# EAGLE design 150555-1-Platino-v1.4 (EAGLE 7.3.0)
AUTHOR: CPV; NRS: 150555-I; REV: 1.4

## Sheet 1 of 3
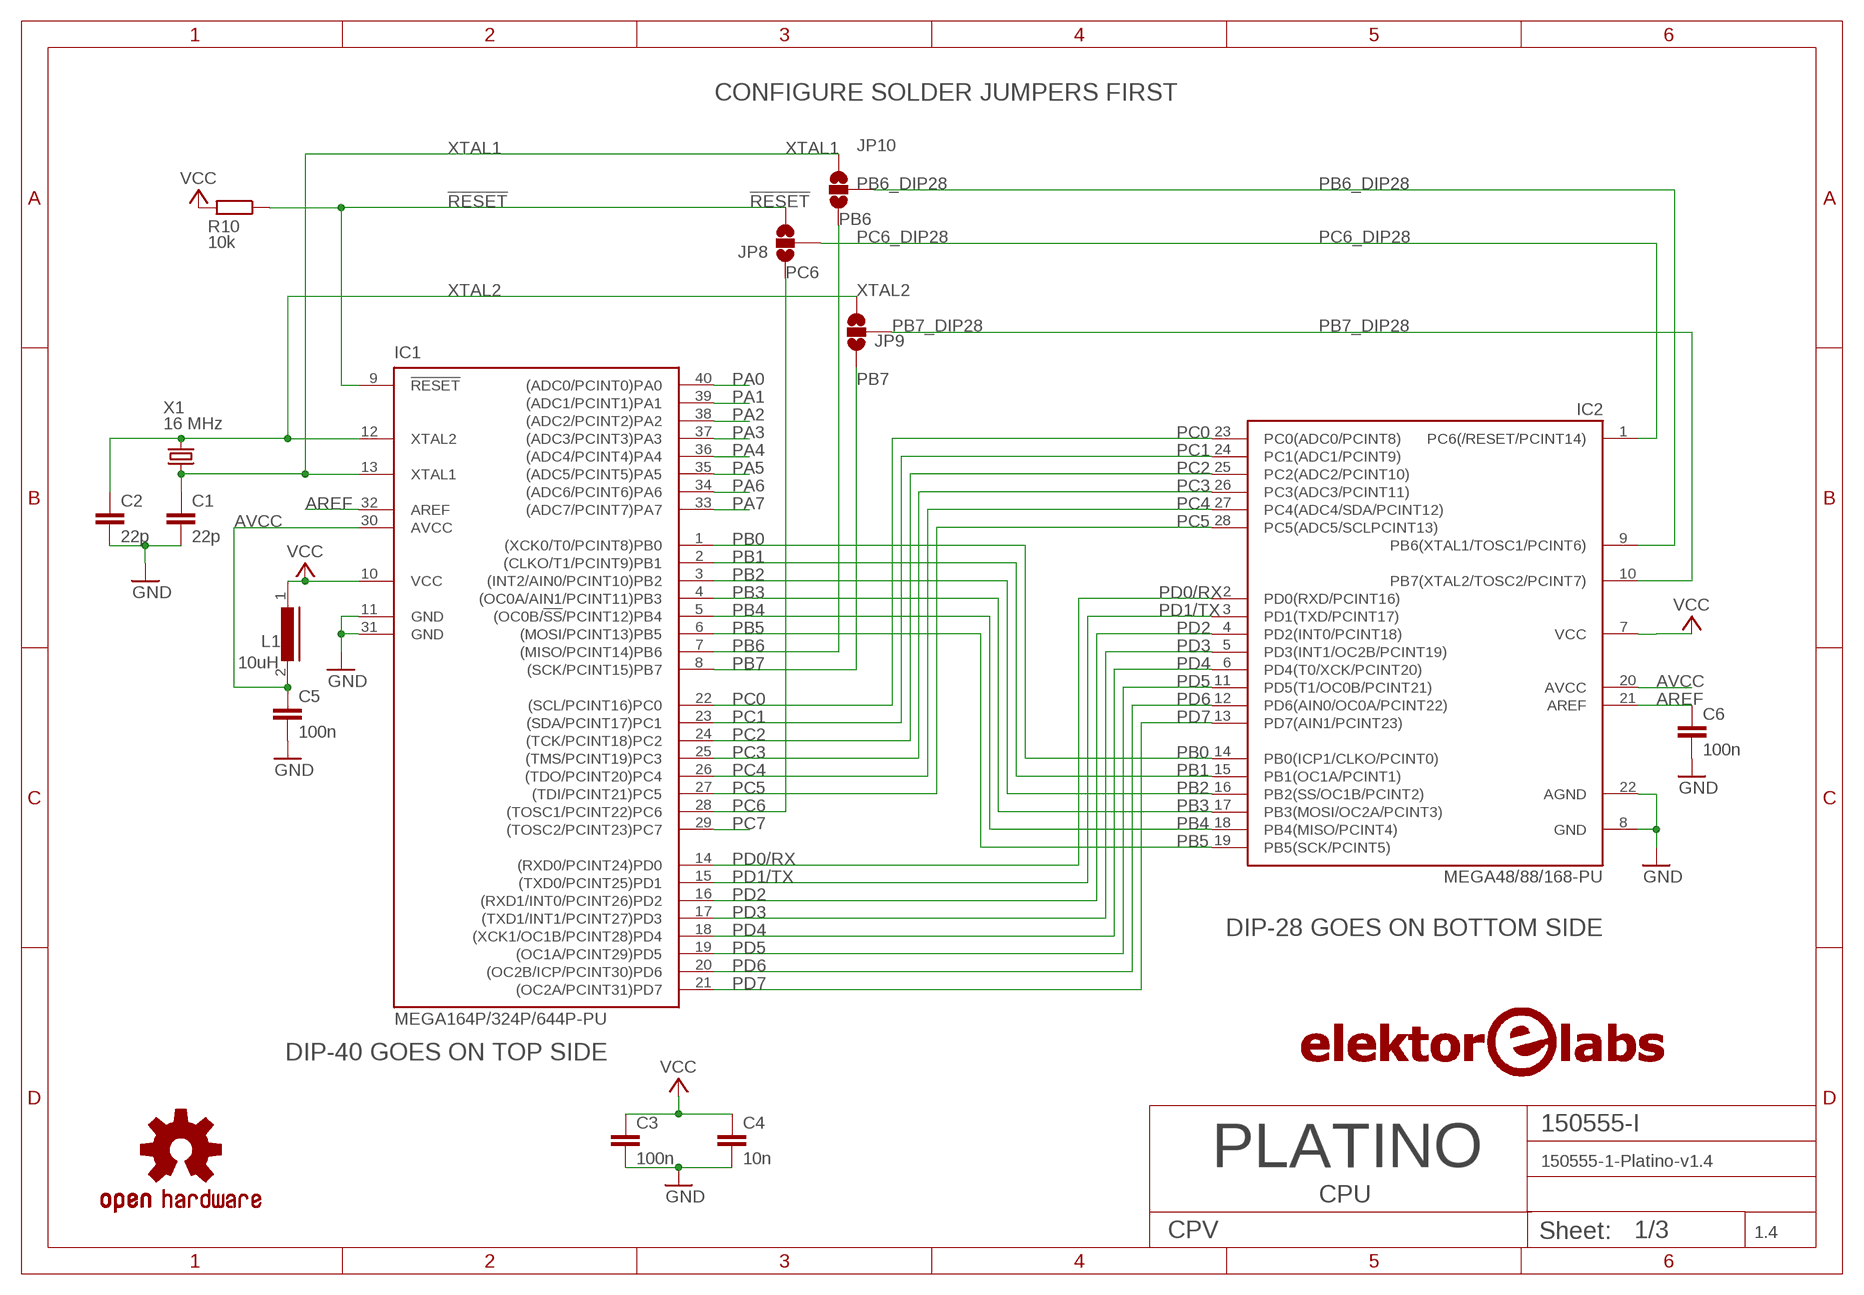
[diagram p0: schematic, sheet 1]

### Parts
C1  22p  C-NP-22PF-2.5MM  [ELPP-CNP-250]
C2  22p  C-NP-22PF-2.5MM  [ELPP-CNP-250]
C3  100n  C-NP-100NF-5.08MM  [ELPP-CNP-508]
C4  10n  C-NP-10NF-2.54MM  [ELPP-CNP-254]
C5  100n  C-NP-100NF-5.08MM  [ELPP-CNP-508]
C6  100n  C-NP-100NF-5.08MM  [ELPP-CNP-508]
IC1  MEGA164P/324P/644P-PU  [DIL40]
IC2  MEGA48/88/168-PU  [DIL28-3]
JP8  SOLDERJUMPER_2WAYT  [SJ_2]
JP9  SOLDERJUMPER_2WAYT  [SJ_2]
JP10  SOLDERJUMPER_2WAYT  [SJ_2]
L1  10uH  L-10UH-10MM  [ELPP-L-0207-1000]
LOGO2  LOGO-ELEKTOR-LABS-25MM  [EPP-LOGO-ELEKTOR-LABS-25MM]
R10  10k  R-10K-10MM  [ELPP-R-0207-1000]
U$2  OSHW-LOGOM  [OSHW-LOGO-M]
X1  16 MHz  X-CRYSTAL-16MHZ-  [ELPP-HC49]

### Nets
!RESET: IC1.9(!RESET) JP8.3 R10.1 ; also sheet 3
AREF: C6.1 IC1.32(AREF) IC2.21(AREF) ; also sheet 3
AVCC: C5.1 IC1.30(AVCC) IC2.20(AVCC) L1.2
GND: C1.2 C2.2 C3.2 C4.2 C5.2 C6.2 IC1.11(GND) IC1.31(GND) IC2.8(GND) IC2.22(AGND) ; also sheet 2,3
PA0: IC1.40((ADC0/PCINT0)PA0) ; also sheet 3
PA1: IC1.39((ADC1/PCINT1)PA1) ; also sheet 3
PA2: IC1.38((ADC2/PCINT2)PA2) ; also sheet 3
PA3: IC1.37((ADC3/PCINT3)PA3) ; also sheet 3
PA4: IC1.36((ADC4/PCINT4)PA4) ; also sheet 3
PA5: IC1.35((ADC5/PCINT5)PA5) ; also sheet 3
PA6: IC1.34((ADC6/PCINT6)PA6) ; also sheet 3
PA7: IC1.33((ADC7/PCINT7)PA7) ; also sheet 3
PB0: IC1.1((XCK0/T0/PCINT8)PB0) IC2.14(PB0(ICP1/CLKO/PCINT0)) ; also sheet 2,3
PB1: IC1.2((CLKO/T1/PCINT9)PB1) IC2.15(PB1(OC1A/PCINT1)) ; also sheet 2,3
PB2: IC1.3((INT2/AIN0/PCINT10)PB2) IC2.16(PB2(SS/OC1B/PCINT2)) ; also sheet 2,3
PB3: IC1.4((OC0A/AIN1/PCINT11)PB3) IC2.17(PB3(MOSI/OC2A/PCINT3)) ; also sheet 2,3
PB4: IC1.5((OC0B/!SS!/PCINT12)PB4) IC2.18(PB4(MISO/PCINT4)) ; also sheet 2,3
PB5: IC1.6((MOSI/PCINT13)PB5) IC2.19(PB5(SCK/PCINT5)) ; also sheet 2,3
PB6: IC1.7((MISO/PCINT14)PB6) JP10.1 ; also sheet 2,3
PB6_DIP28: IC2.9(PB6(XTAL1/TOSC1/PCINT6)) JP10.2
PB7: IC1.8((SCK/PCINT15)PB7) JP9.1 ; also sheet 2,3
PB7_DIP28: IC2.10(PB7(XTAL2/TOSC2/PCINT7)) JP9.2
PC0: IC1.22((SCL/PCINT16)PC0) IC2.23(PC0(ADC0/PCINT8)) ; also sheet 2,3
PC1: IC1.23((SDA/PCINT17)PC1) IC2.24(PC1(ADC1/PCINT9)) ; also sheet 2,3
PC2: IC1.24((TCK/PCINT18)PC2) IC2.25(PC2(ADC2/PCINT10)) ; also sheet 2,3
PC3: IC1.25((TMS/PCINT19)PC3) IC2.26(PC3(ADC3/PCINT11)) ; also sheet 2,3
PC4: IC1.26((TDO/PCINT20)PC4) IC2.27(PC4(ADC4/SDA/PCINT12)) ; also sheet 2,3
PC5: IC1.27((TDI/PCINT21)PC5) IC2.28(PC5(ADC5/SCLPCINT13)) ; also sheet 2,3
PC6: IC1.28((TOSC1/PCINT22)PC6) JP8.1 ; also sheet 2,3
PC6_DIP28: IC2.1(PC6(/RESET/PCINT14)) JP8.2
PC7: IC1.29((TOSC2/PCINT23)PC7) ; also sheet 2,3
PD0/RX: IC1.14((RXD0/PCINT24)PD0) IC2.2(PD0(RXD/PCINT16)) ; also sheet 3
PD1/TX: IC1.15((TXD0/PCINT25)PD1) IC2.3(PD1(TXD/PCINT17)) ; also sheet 3
PD2: IC1.16((RXD1/INT0/PCINT26)PD2) IC2.4(PD2(INT0/PCINT18)) ; also sheet 2,3
PD3: IC1.17((TXD1/INT1/PCINT27)PD3) IC2.5(PD3(INT1/OC2B/PCINT19)) ; also sheet 2,3
PD4: IC1.18((XCK1/OC1B/PCINT28)PD4) IC2.6(PD4(T0/XCK/PCINT20)) ; also sheet 2,3
PD5: IC1.19((OC1A/PCINT29)PD5) IC2.11(PD5(T1/OC0B/PCINT21)) ; also sheet 2,3
PD6: IC1.20((OC2B/ICP/PCINT30)PD6) IC2.12(PD6(AIN0/OC0A/PCINT22)) ; also sheet 2,3
PD7: IC1.21((OC2A/PCINT31)PD7) IC2.13(PD7(AIN1/PCINT23)) ; also sheet 2,3
VCC: C3.1 C4.1 IC1.10(VCC) IC2.7(VCC) L1.1 R10.2 ; also sheet 2,3
XTAL1: C1.1 IC1.13(XTAL1) JP10.3 X1.1
XTAL2: C2.1 IC1.12(XTAL2) JP9.3 X1.2

### Notes on the sheet
- CONFIGURE SOLDER JUMPERS FIRST
- DIP-28 GOES ON BOTTOM SIDE
- DIP-40 GOES ON TOP SIDE
- PLATINO
- CPU

## Sheet 2 of 3
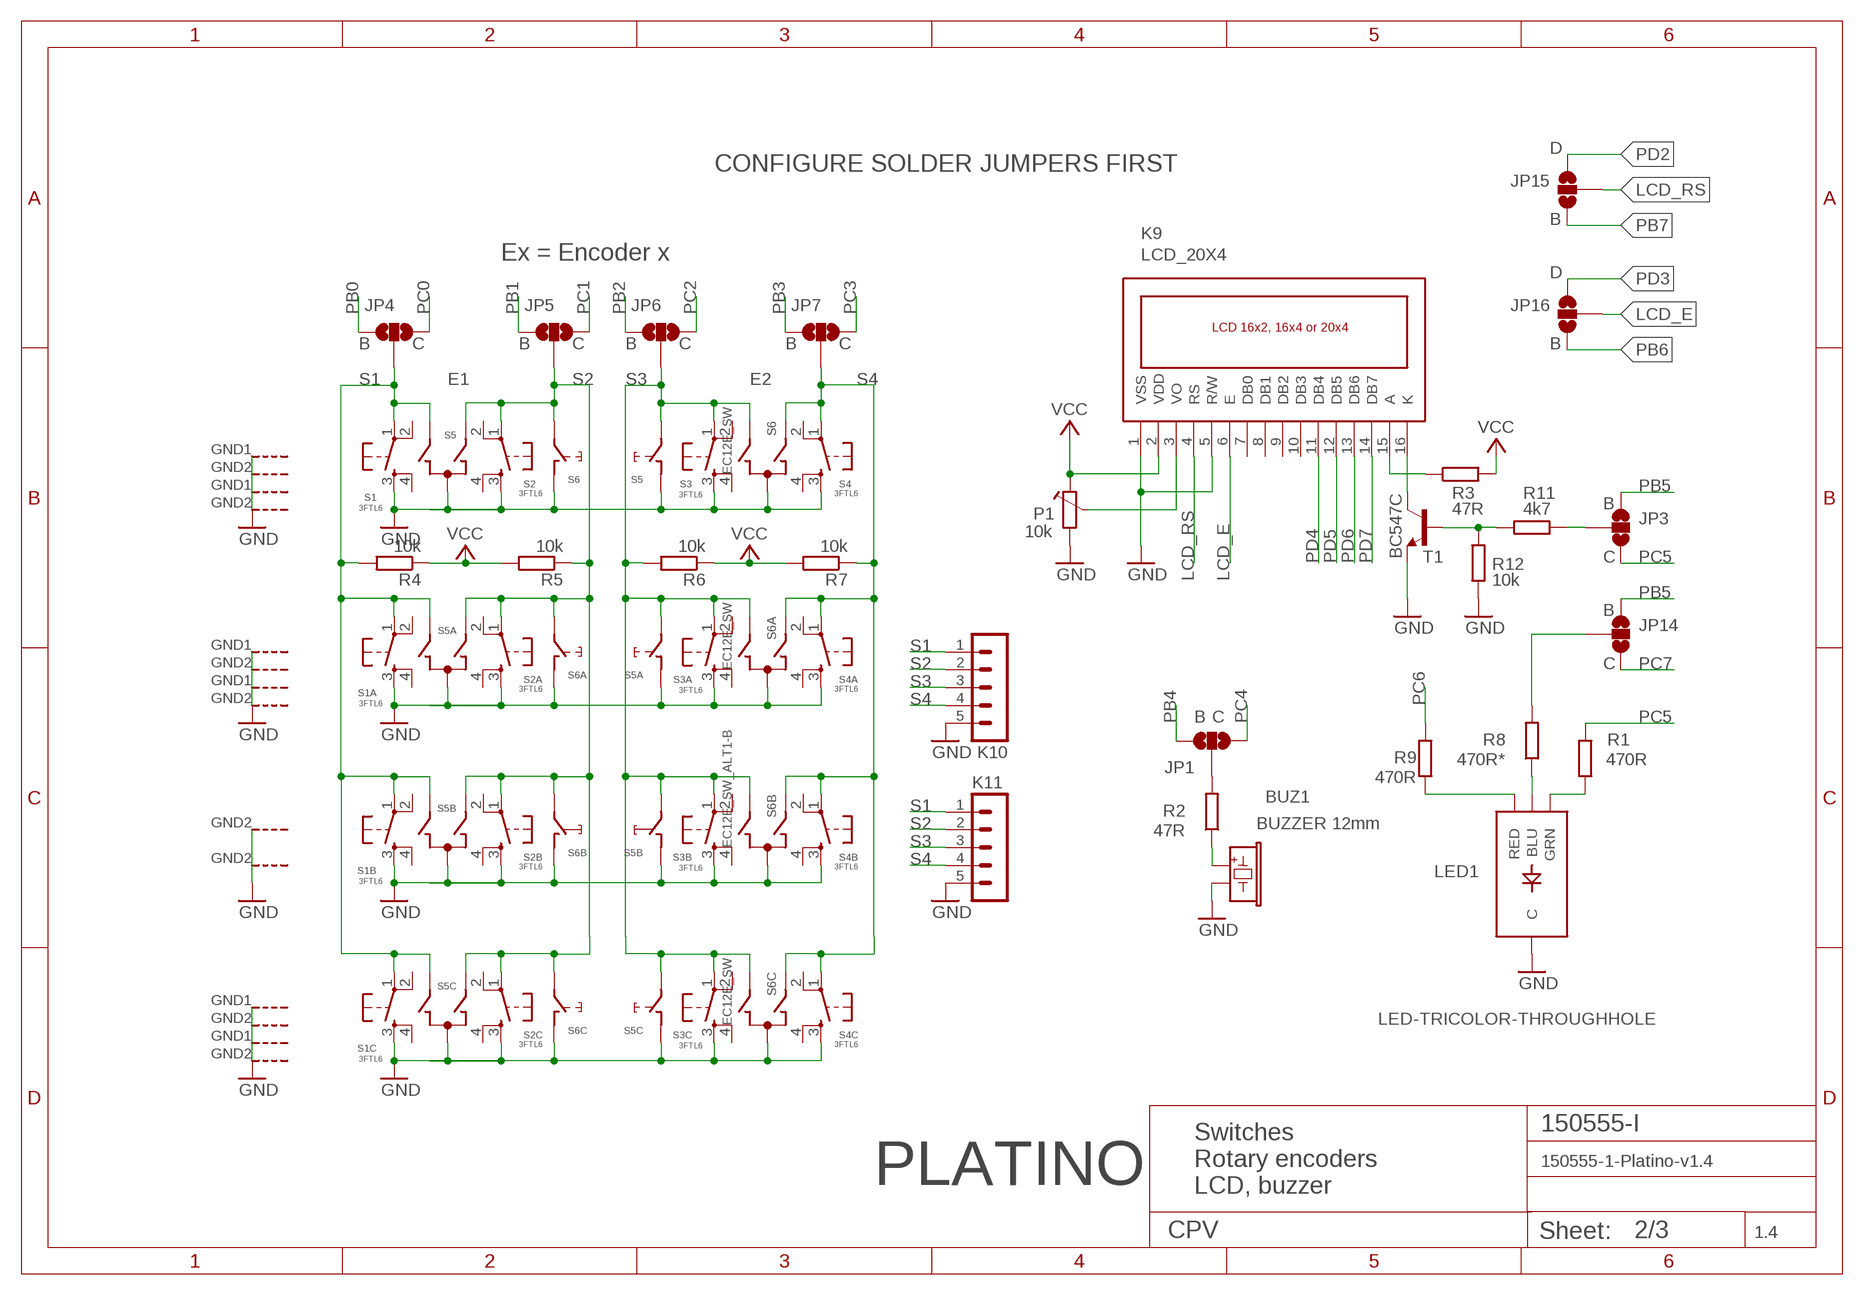
[diagram p1: schematic, sheet 2]

### Parts
BUZ1  BUZZER 12mm  BUZ-BUZZER-12MM  [ELPP-BUZZER-12MM]
JP1  SOLDERJUMPER_2WAYT  [SJ_2]
JP3  SOLDERJUMPER_2WAYT  [SJ_2]
JP4  SOLDERJUMPER_2WAYT  [SJ_2]
JP5  SOLDERJUMPER_2WAYT  [SJ_2]
JP6  SOLDERJUMPER_2WAYT  [SJ_2]
JP7  SOLDERJUMPER_2WAYT  [SJ_2]
JP14  SOLDERJUMPER_2WAYT  [SJ_2]
JP15  SOLDERJUMPER_2WAYT  [SJ_2]
JP16  SOLDERJUMPER_2WAYT  [SJ_2]
K9  LCD_20X4  LCD_MULTI2  [LCD_MULTI2]
K10  K-HEADER-MALE-1X5-V  [ELPP-SIL-M-5-WAY]
K11  K-HEADER-MALE-1X5-V  [ELPP-SIL-M-5-WAY]
LED1  LED-TRICOLOR-THROUGHHOLE  [LED-TRICOLOR-THROUGHHOLE]
P1  10k  P-TRIMMER-10K-PT-10  [ELPP-TRIMMER-CB10-H]
R1  470R  R-470R-10MM  [ELPP-R-0207-1000]
R2  47R  R-47R-10MM  [ELPP-R-0207-1000]
R3  47R  R-47R-10MM  [ELPP-R-0207-1000]
R4  10k  R-10K-10MM  [ELPP-R-0207-1000]
R5  10k  R-10K-10MM  [ELPP-R-0207-1000]
R6  10k  R-10K-10MM  [ELPP-R-0207-1000]
R7  10k  R-10K-10MM  [ELPP-R-0207-1000]
R8  470R*  R-470R-10MM  [ELPP-R-0207-1000]
R9  470R  R-470R-10MM  [ELPP-R-0207-1000]
R11  4k7  R-4K7-10MM  [ELPP-R-0207-1000]
R12  10k  R-10K-10MM  [ELPP-R-0207-1000]
S1  3FTL6  PUSHBUTTON_MULTIMEC  [PUSHBUTTON_MULTIMEC]
S1A  3FTL6  PUSHBUTTON_MULTIMEC  [PUSHBUTTON_MULTIMEC]
S1B  3FTL6  PUSHBUTTON_MULTIMEC  [PUSHBUTTON_MULTIMEC]
S1C  3FTL6  PUSHBUTTON_MULTIMEC  [PUSHBUTTON_MULTIMEC]
S2  3FTL6  PUSHBUTTON_MULTIMEC  [PUSHBUTTON_MULTIMEC]
S2A  3FTL6  PUSHBUTTON_MULTIMEC  [PUSHBUTTON_MULTIMEC]
S2B  3FTL6  PUSHBUTTON_MULTIMEC  [PUSHBUTTON_MULTIMEC]
S2C  3FTL6  PUSHBUTTON_MULTIMEC  [PUSHBUTTON_MULTIMEC]
S3  3FTL6  PUSHBUTTON_MULTIMEC  [PUSHBUTTON_MULTIMEC]
S3A  3FTL6  PUSHBUTTON_MULTIMEC  [PUSHBUTTON_MULTIMEC]
S3B  3FTL6  PUSHBUTTON_MULTIMEC  [PUSHBUTTON_MULTIMEC]
S3C  3FTL6  PUSHBUTTON_MULTIMEC  [PUSHBUTTON_MULTIMEC]
S4  3FTL6  PUSHBUTTON_MULTIMEC  [PUSHBUTTON_MULTIMEC]
S4A  3FTL6  PUSHBUTTON_MULTIMEC  [PUSHBUTTON_MULTIMEC]
S4B  3FTL6  PUSHBUTTON_MULTIMEC  [PUSHBUTTON_MULTIMEC]
S4C  3FTL6  PUSHBUTTON_MULTIMEC  [PUSHBUTTON_MULTIMEC]
S5  EC12E_SW  [ALPS_EC12E_SW]
S5A  EC12E_SW  [ALPS_EC12E_SW]
S5B  EC12E_SW_ALT1-B  [ALPS_EC12E_SW_ALT2]
S5C  EC12E_SW  [ALPS_EC12E_SW]
S6  EC12E_SW  [ALPS_EC12E_SW]
S6A  EC12E_SW  [ALPS_EC12E_SW]
S6B  EC12E_SW_ALT1-B  [ALPS_EC12E_SW_ALT2]
S6C  EC12E_SW  [ALPS_EC12E_SW]
T1  BC547C  TRANSISTOR_NPNTO92  [TO-92]

### Nets
BLUE: LED1.BLU R8.1
GATE: JP3.2 R11.2
GND: BUZ1.- K9.1(VSS) K9.5(R/W) K10.5 K11.5 LED1.GND(C) P1.1 R12.1 S1.3 S1A.3 S1B.3 S1C.3 S2.3 S2A.3 S2B.3 S2C.3 S3.3 S3A.3 S3B.3 S3C.3 S4.3 S4A.3 S4B.3 S4C.3 S5.C S5.D S5.GND1(G) S5.GND2(G) S5A.C S5A.D S5A.GND1(G) S5A.GND2(G) S5B.C S5B.D S5B.GND2(G) S5C.C S5C.D S5C.GND1(G) S5C.GND2(G) S6.C S6.D S6.GND1(G) S6.GND2(G) S6A.C S6A.D S6A.GND1(G) S6A.GND2(G) S6B.C S6B.D S6B.GND2(G) S6C.C S6C.D S6C.GND1(G) S6C.GND2(G) T1.1(E) ; also sheet 1,3
GREEN: LED1.GRN R1.1
LCD_BL_A: K9.15(A) R3.1
LCD_BL_K: K9.16(K) T1.3(C)
LCD_E: JP16.2 K9.6(E)
LCD_RS: JP15.2 K9.4(RS)
LCD_VO: K9.3(VO) P1.3
N$2: BUZ1.+ R2.1
N$5: R11.1 R12.2 T1.2(B)
N$7: JP1.2 R2.2
N$8: JP14.2 R8.2
PB0: JP4.1 ; also sheet 1,3
PB1: JP5.1 ; also sheet 1,3
PB2: JP6.1 ; also sheet 1,3
PB3: JP7.1 ; also sheet 1,3
PB4: JP1.1 ; also sheet 1,3
PB5: JP3.3 JP14.3 ; also sheet 1,3
PB6: JP16.1 ; also sheet 1,3
PB7: JP15.1 ; also sheet 1,3
PC0: JP4.3 ; also sheet 1,3
PC1: JP5.3 ; also sheet 1,3
PC2: JP6.3 ; also sheet 1,3
PC3: JP7.3 ; also sheet 1,3
PC4: JP1.3 ; also sheet 1,3
PC5: JP3.1 R1.2 ; also sheet 1,3
PC6: R9.2 ; also sheet 1,3
PC7: JP14.1 ; also sheet 1,3
PD2: JP15.3 ; also sheet 1,3
PD3: JP16.3 ; also sheet 1,3
PD4: K9.11(DB4) ; also sheet 1,3
PD5: K9.12(DB5) ; also sheet 1,3
PD6: K9.13(DB6) ; also sheet 1,3
PD7: K9.14(DB7) ; also sheet 1,3
RED: LED1.RED R9.1
S1: JP4.2 K10.1 K11.1 R4.2 S1.1 S1A.1 S1B.1 S1C.1 S5.B S5A.B S5B.B S5C.B
S2: JP5.2 K10.2 K11.2 R5.1 S2.1 S2A.1 S2B.1 S2C.1 S5.A S5A.A S5B.A S5C.A S6.E S6A.E S6B.E S6C.E
S3: JP6.2 K10.3 K11.3 R6.2 S3.1 S3A.1 S3B.1 S3C.1 S5.E S5A.E S5B.E S5C.E S6.B S6A.B S6B.B S6C.B
S4: JP7.2 K10.4 K11.4 R7.1 S4.1 S4A.1 S4B.1 S4C.1 S6.A S6A.A S6B.A S6C.A
VCC: K9.2(VDD) P1.2 R3.2 R4.1 R5.2 R6.1 R7.2 ; also sheet 1,3
Unconnected: K9.7(DB0) K9.8(DB1) K9.9(DB2) K9.10(DB3) S1.2 S1.4 S1A.2 S1A.4 S1B.2 S1B.4 S1C.2 S1C.4 S2.2 S2.4 S2A.2 S2A.4 S2B.2 S2B.4 S2C.2 S2C.4 S3.2 S3.4 S3A.2 S3A.4 S3B.2 S3B.4 S3C.2 S3C.4 S4.2 S4.4 S4A.2 S4A.4 S4B.2 S4B.4 S4C.2 S4C.4

### Notes on the sheet
- D
- CONFIGURE SOLDER JUMPERS FIRST
- B
- Ex = Encoder x
- D
- B | C | B | C | B | C | B | C | B
- E1 | E2
- B
- C
- B
- C
- B | C
- Switches
- Rotary encoders
- PLATINO
- LCD, buzzer

## Sheet 3 of 3
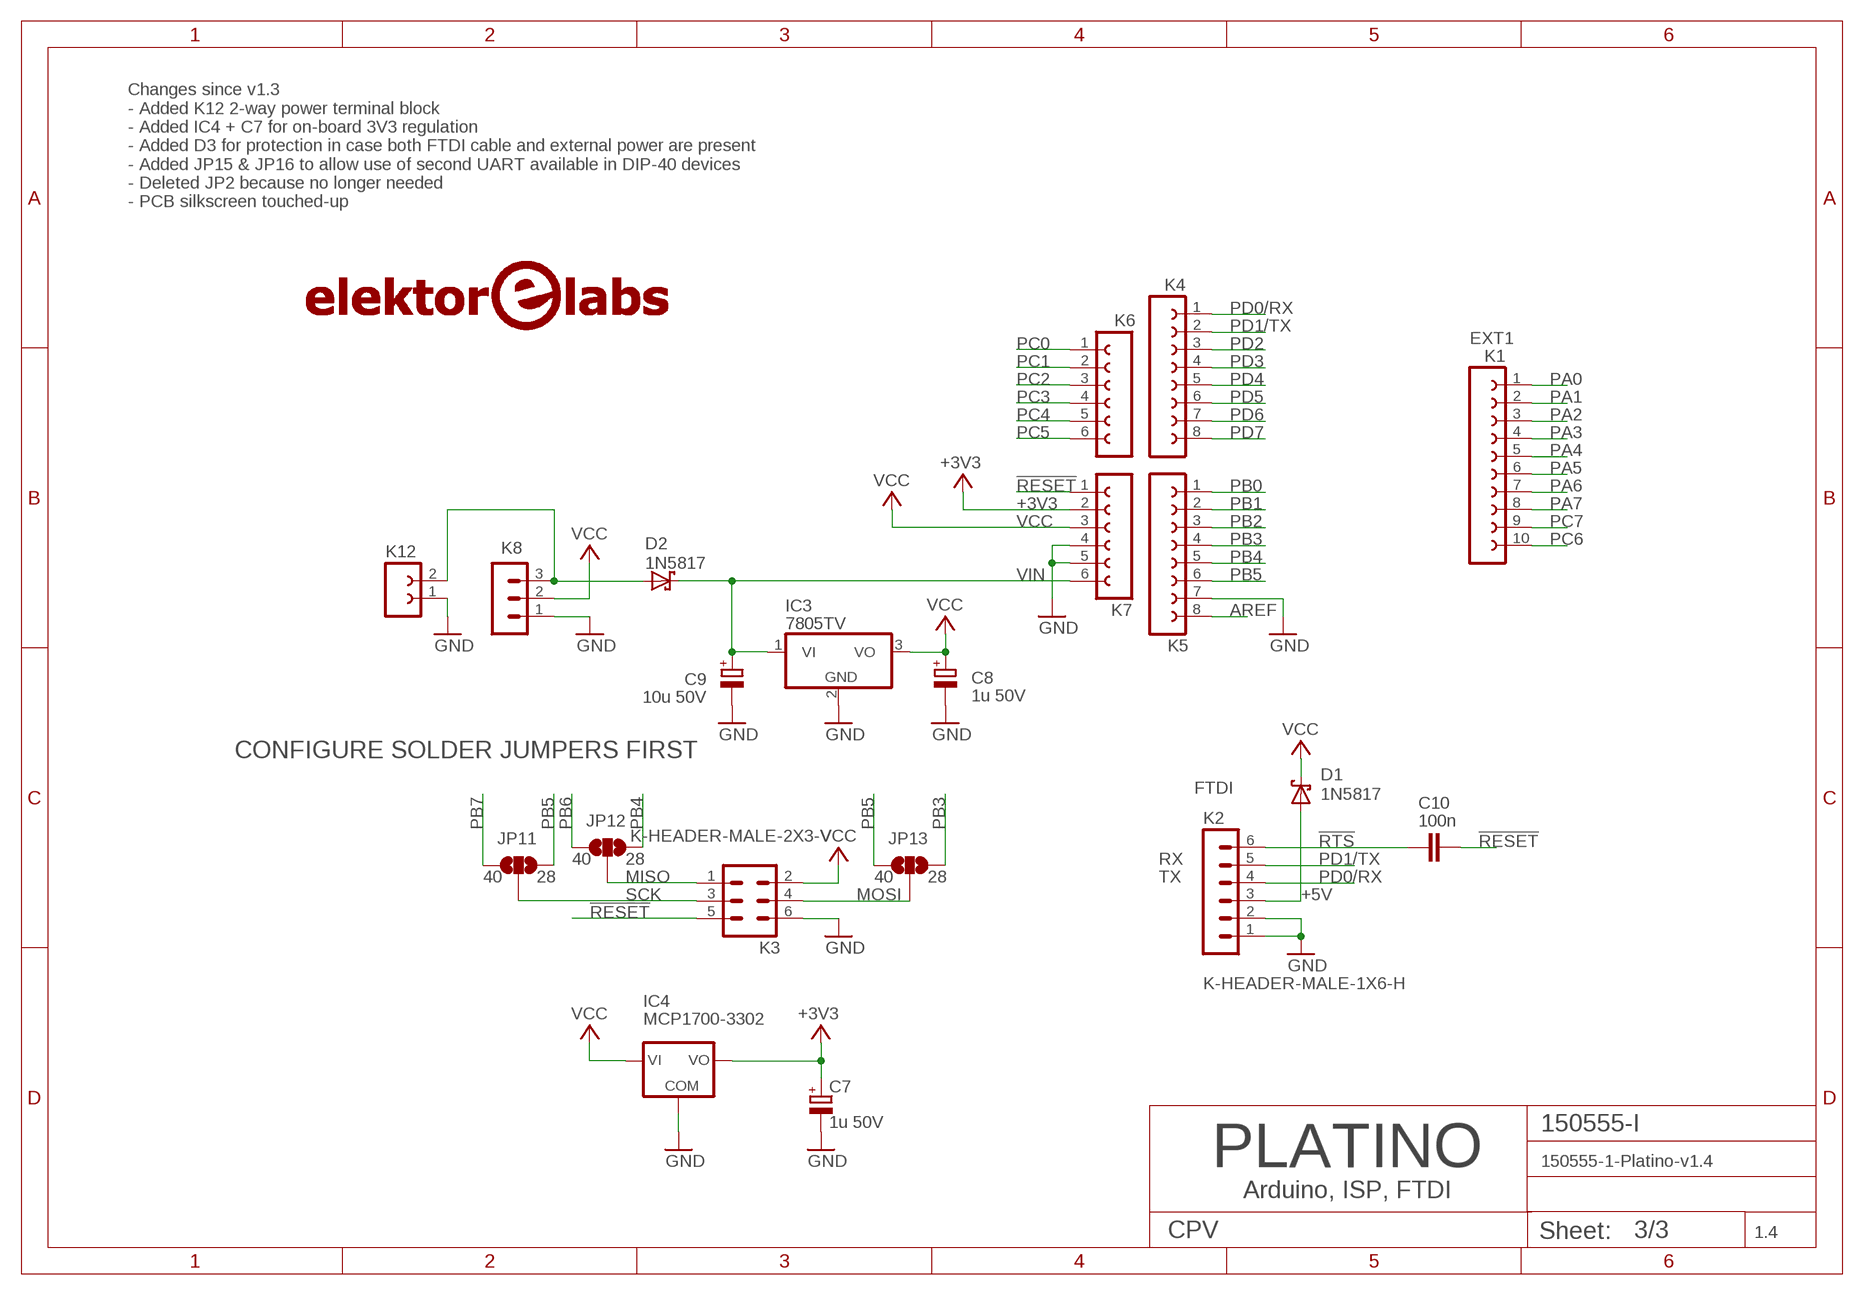
[diagram p2: schematic, sheet 3]

### Parts
C7  1u 50V  C-POL-1UF-200-500  [ELPP-CP-200-500]
C8  1u 50V  C-POL-1UF-200-500  [ELPP-CP-200-500]
C9  10u 50V  C-POL-10UF-200-500  [ELPP-CP-200-500]
C10  100n  C-NP-100NF-5.08MM  [ELPP-CNP-508]
D1  1N5817  D-SCHOTTKY-1N5817-D041  [ELPP-DO-41]
D2  1N5817  D-SCHOTTKY-1N5817-D041  [ELPP-DO-41]
IC3  7805TV  [TO220V]
IC4  MCP1700-3302  IC-REGULATOR-3V3-MCP1700  [ELPP-TO-92]
JP11  SOLDERJUMPER_2WAYT  [SJ_2]
JP12  SOLDERJUMPER_2WAYT  [SJ_2]
JP13  SOLDERJUMPER_2WAYT  [SJ_2]
K1  EXT1  K-HEADER-FEMALE-1X10-V  [ELPP-SIL-F-10-WAY]
K2  K-HEADER-MALE-1X6-H  [ELPP-SIL-M-6-WAY-90DEG]
K3  K-HEADER-MALE-2X3-V  [ELPP-DIL-M-6-WAY-V]
K4  K-HEADER-FEMALE-1X8-V  [ELPP-SIL-F-8-WAY]
K5  K-HEADER-FEMALE-1X8-V  [ELPP-SIL-F-8-WAY]
K6  K-HEADER-FEMALE-1X6-V  [ELPP-SIL-F-6-WAY]
K7  K-HEADER-FEMALE-1X6-V  [ELPP-SIL-F-6-WAY]
K8  K-HEADER-MALE-1X3-V  [ELPP-SIL-M-3-WAY]
K12  K-TERMINAL-BLOCK-1X2-350  [ELPP-TB-350-2]
LOGO1  LOGO-ELEKTOR-LABS-25MM  [EPP-LOGO-ELEKTOR-LABS-25MM]

### Nets
!RESET: C10.2 K3.5 K7.1 ; also sheet 1
!RTS: C10.1 K2.6
+3V3: C7.+ IC4.3(VO) K7.2
+5V: D1.A K2.3
AREF: K5.8 ; also sheet 1
GND: C7.- C8.- C9.- IC3.2(GND) IC4.1(COM) K2.1 K2.2 K3.6 K5.7 K7.4 K7.5 K8.1 K12.1 ; also sheet 1,2
MISO: JP12.2 K3.1
MOSI: JP13.2 K3.4
N$9: D2.A K8.3 K12.2
PA0: K1.1 ; also sheet 1
PA1: K1.2 ; also sheet 1
PA2: K1.3 ; also sheet 1
PA3: K1.4 ; also sheet 1
PA4: K1.5 ; also sheet 1
PA5: K1.6 ; also sheet 1
PA6: K1.7 ; also sheet 1
PA7: K1.8 ; also sheet 1
PB0: K5.1 ; also sheet 1,2
PB1: K5.2 ; also sheet 1,2
PB2: K5.3 ; also sheet 1,2
PB3: JP13.3 K5.4 ; also sheet 1,2
PB4: JP12.3 K5.5 ; also sheet 1,2
PB5: JP11.3 JP13.1 K5.6 ; also sheet 1,2
PB6: JP12.1 ; also sheet 1,2
PB7: JP11.1 ; also sheet 1,2
PC0: K6.1 ; also sheet 1,2
PC1: K6.2 ; also sheet 1,2
PC2: K6.3 ; also sheet 1,2
PC3: K6.4 ; also sheet 1,2
PC4: K6.5 ; also sheet 1,2
PC5: K6.6 ; also sheet 1,2
PC6: K1.10 ; also sheet 1,2
PC7: K1.9 ; also sheet 1,2
PD0/RX: K2.4 K4.1 ; also sheet 1
PD1/TX: K2.5 K4.2 ; also sheet 1
PD2: K4.3 ; also sheet 1,2
PD3: K4.4 ; also sheet 1,2
PD4: K4.5 ; also sheet 1,2
PD5: K4.6 ; also sheet 1,2
PD6: K4.7 ; also sheet 1,2
PD7: K4.8 ; also sheet 1,2
SCK: JP11.2 K3.3
VCC: C8.+ D1.C IC3.3(VO) IC4.2(VI) K3.2 K7.3 K8.2 ; also sheet 1,2
VIN: C9.+ D2.C IC3.1(VI) K7.6

### Notes on the sheet
- Changes since v1.3
  - Added K12 2-way power terminal block
  - Added IC4 + C7 for on-board 3V3 regulation
  - Added D3 for protection in case both FTDI cable and external power are present
  - Added JP15 & JP16 to allow use of second UART available in DIP-40 devices
  - Deleted JP2 because no longer needed
  - PCB silkscreen touched-up
- CONFIGURE SOLDER JUMPERS FIRST
- FTDI
- 40 | 28 | RX
- 40 | 28 | 40 | 28 | TX
- PLATINO
- Arduino, ISP, FTDI

## Library data of the parts
BUZ1 = elpp-tht-v1.3:BUZ-BUZZER-: Buzzer; FARNELL: 1022402; RS: 6173081
C1 C2 = elpp-tht-v1.3:C-NP-*: Capacitor, non-polarised, fixed value.; FARNELL: 9411674; RS: 5373634
C3 C5 C6 C10 = elpp-tht-v1.3:C-NP-*: Capacitor, non-polarised, fixed value.; FARNELL: 1216440; RS: 5373707
C4 = elpp-tht-v1.3:C-NP-*: Capacitor, non-polarised, fixed value.; FARNELL: 1216435; RS: 7368827
C7 C8 = elpp-tht-v1.3:C-POL-*: Capacitor, polarised, fixed value.; FARNELL: 9451358; RS: 2286846
C9 = elpp-tht-v1.3:C-POL-*: Capacitor, polarised, fixed value.; FARNELL: 9451382; RS: 2286874
D1 D2 = elpp-tht-v1.3:D-SCHOTTKY-*-: Diode, Schottky; FARNELL: 9801197; RS: 7146807
IC1 = avr-6:MEGA164P/324P/644P-PU
IC2 = avr-6:MEGA48/88/168-PU
IC3 = linear:78*: Positive VOLTAGE REGULATOR Source: http://cache.national.com/ds/LM/LM78L05.pdf http://www.fairchildsemi.com/ds/LM/LM7805.pdf
IC4 = elpp-tht-v1.3:IC-REGULATOR-*-: VOLTAGE REGULATOR, linear, 3-pin types; FARNELL: 1296588; RS: 403888
JP1 JP3-JP16 = SparkFun:SOLDERJUMPER_2WAY: Solder Jumper 2 way solder jumper
K1 = elpp-tht-v1.3:K-HEADER-FEMALE-1X10-: FEMALE HEADER; FARNELL: 9728856; RS: unknown
K2 = elpp-tht-v1.3:K-HEADER-MALE-1X6-: PIN HEADER; FARNELL: 1098476; RS: 6812060
K3 = elpp-tht-v1.3:K-HEADER-MALE-2X3-: PIN HEADER 2 rows, 90 degrees; FARNELL: 1098460; RS: 6812067
K4 K5 = elpp-tht-v1.3:K-HEADER-FEMALE-1X8-: FEMALE HEADER; FARNELL: 9728856; RS: unknown
K6 K7 = elpp-tht-v1.3:K-HEADER-FEMALE-1X6-: FEMALE HEADER; FARNELL: 9728856; RS: unknown
K8 = elpp-tht-v1.3:K-HEADER-MALE-1X3-: PIN HEADER; FARNELL: 1098454; RS: 6812058
K9 = 100892-1 Platino v1.4:LCD_MULTI2
K10 K11 = elpp-tht-v1.3:K-HEADER-MALE-1X5-: PIN HEADER; FARNELL: 1098454; RS: 6812058
K12 = elpp-tht-v1.3:K-TERMINAL-BLOCK-1X2-: PCB terminal block, 2-way; FARNELL: 1098611; RS: 7100444
L1 = elpp-tht-v1.4:L-*-: Inductor; FARNELL: 1180270; RS: 8604060
LED1 = SparkFun:LED-TRICOLOR-THROUGHHOLE
LOGO1 LOGO2 = elpp-v1.1:LOGO-ELEKTOR-LABS: Logo, Elektor.Labs
P1 = elpp-tht-v1.3:P-TRIMMER-*-: Resistor, adjustable; FARNELL: 1227569; RS: 473473
R1 R8 R9 = elpp-tht-v1.3:R-*-: Resistor, E12, 0.25W, 10.16 mm and 12.7 mm pitches are available.; FARNELL: 9339531; RS: 135831
R2 R3 = elpp-tht-v1.3:R-*-: Resistor, E12, 0.25W, 10.16 mm and 12.7 mm pitches are available.; FARNELL: 9339523; RS: 135768
R4-R7 R10 R12 = elpp-tht-v1.3:R-*-: Resistor, E12, 0.25W, 10.16 mm and 12.7 mm pitches are available.; FARNELL: 9339060; RS: 135910
R11 = elpp-tht-v1.3:R-*-: Resistor, E12, 0.25W, 10.16 mm and 12.7 mm pitches are available.; FARNELL: 9339540; RS: 135904
S1 S1A S1B S1C S2 S2A S2B S2C S3 S3A S3B S3C S4 S4A S4B S4C = 000_cpv:PUSHBUTTON_MULTIMEC
S5 S5A S5C S6 S6A S6C = 000_cpv:EC12E_SW: ALPS rotary Encoder EC12E series with switch; MPN: EC12E2424407; OC_FARNELL: 1520813; OC_NEWARK: 74M1068
S5B S6B = 150555-1-Platino-v1.4:EC12E_SW_ALT1: ALPS rotary Encoder EC12E series with switch, Specialty for Platino
T1 = SparkFun:TRANSISTOR_NPN: Transistor NPN BJT configuration in SOT23 package. MMBT2222 is the common NPN we use. Double check BCE configuration again layout.
U$2 = SparkFun-Aesthetics:OSHW-LOGO: Open Source Hardware Logo This logo indicates the piece of hardware it is found on incorporates a OSHW license and/or adheres to the definition of open source hardware found here: http://freedomdefined.org/OSHW
X1 = elpp-tht-v1.3:X-CRYSTAL-*-; FARNELL: 1611761; RS: 6938819

## Board
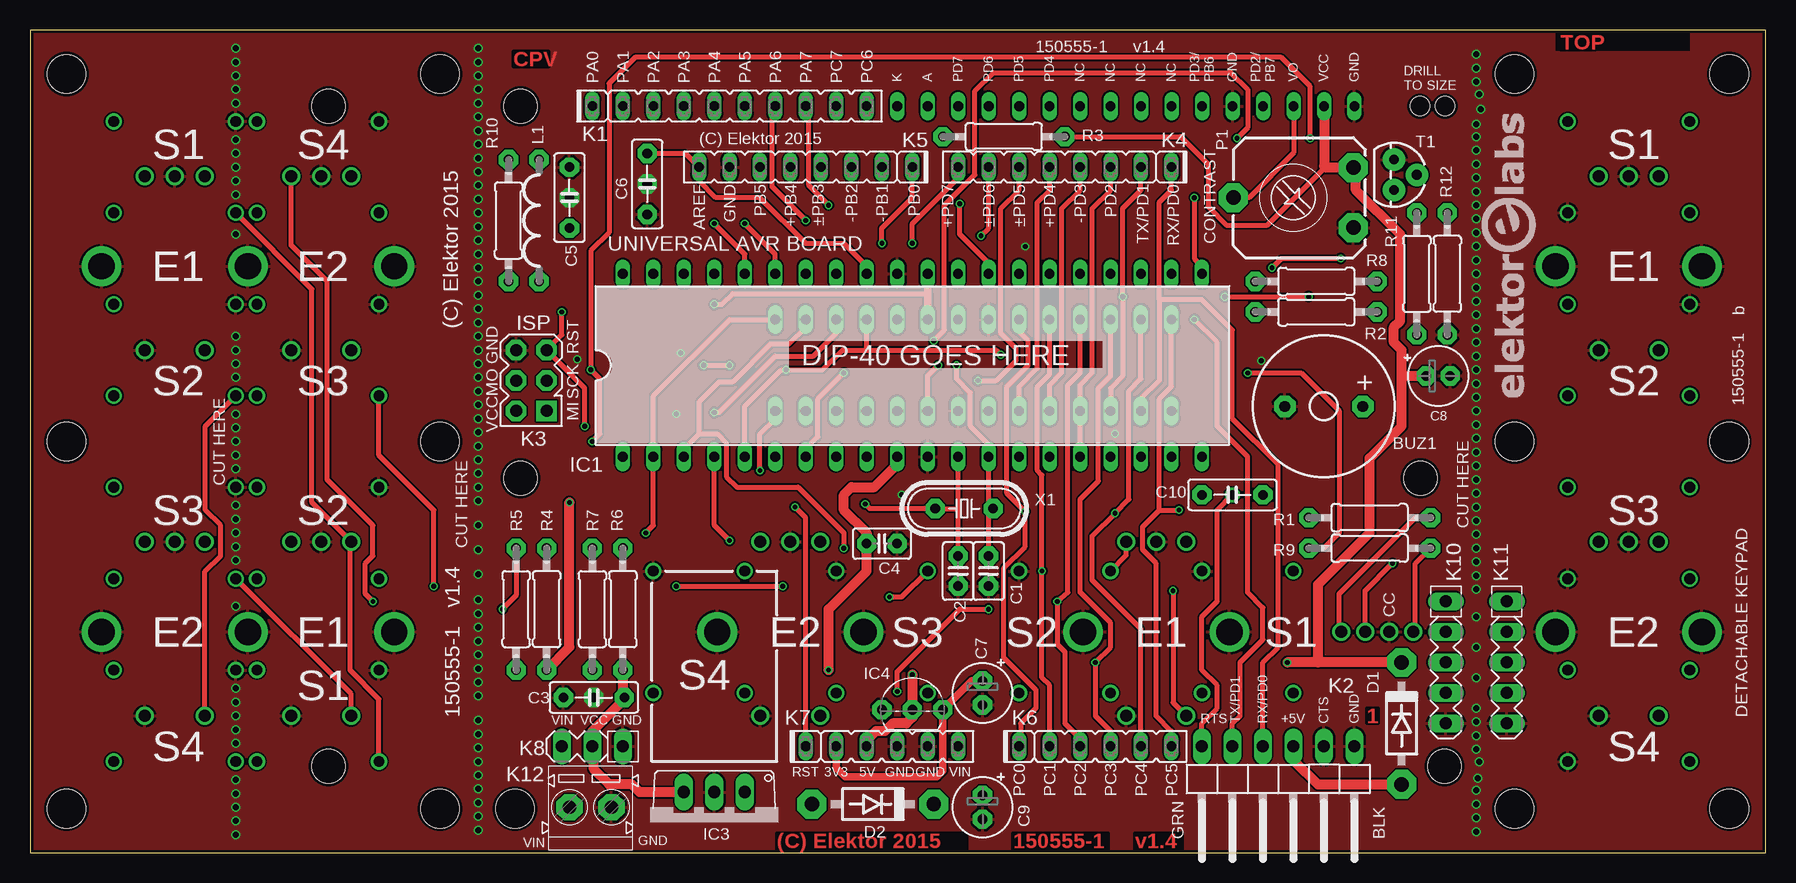
[diagram p3: board, top side]
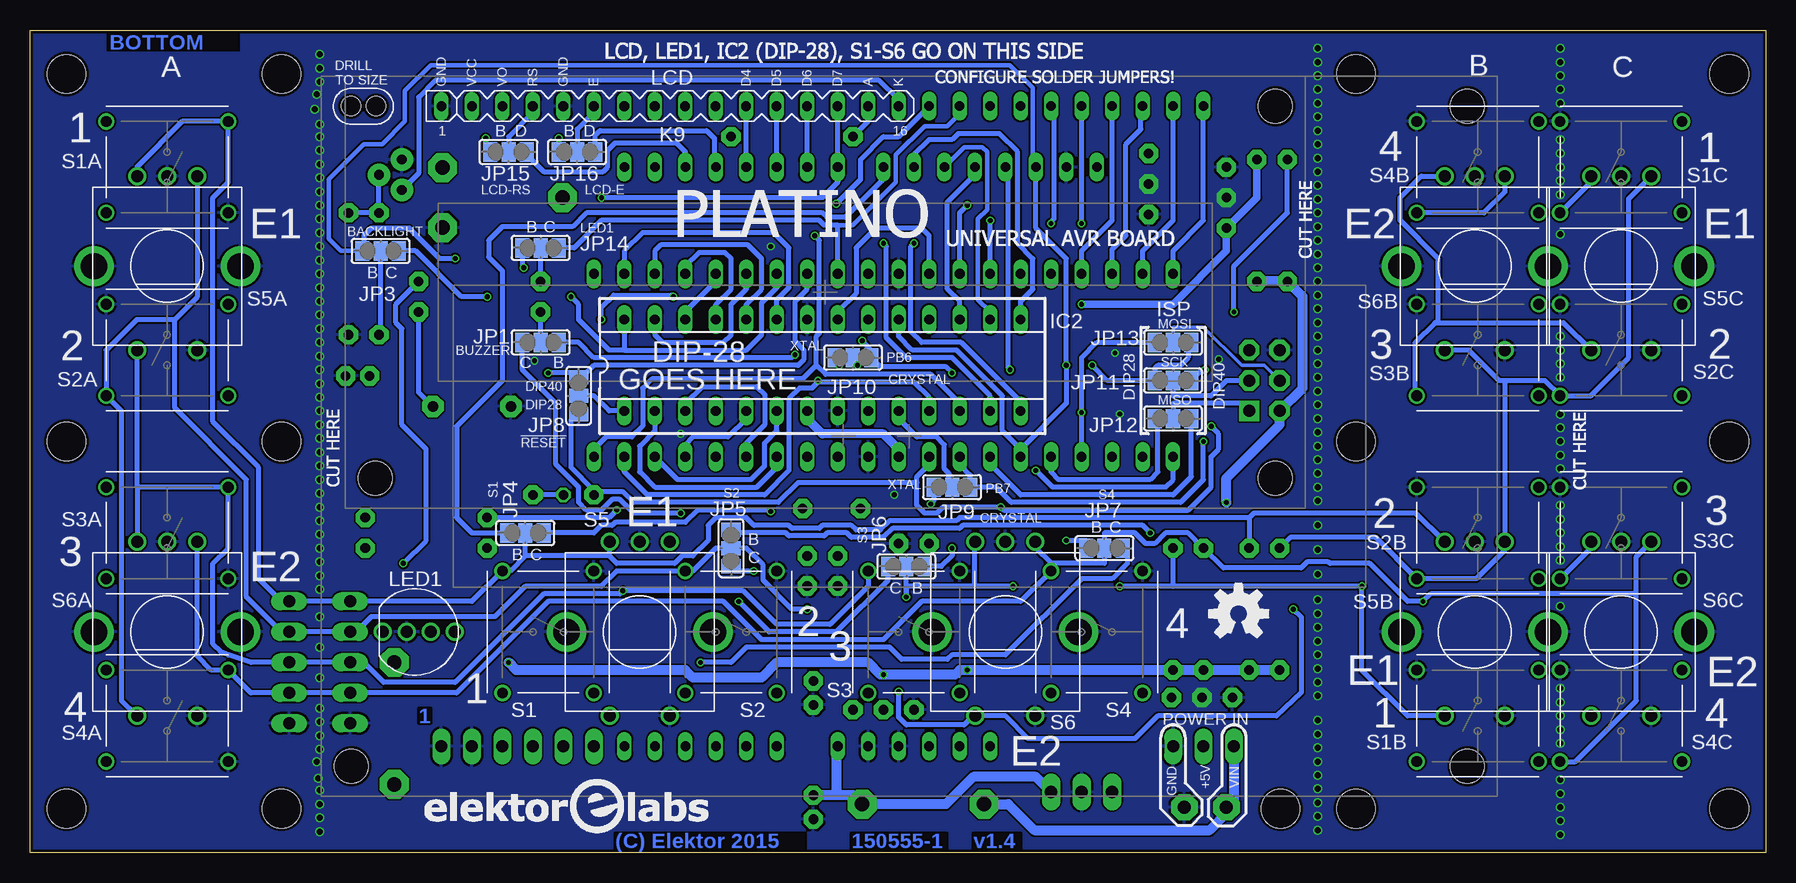
[diagram p4: board, bottom side, seen from below]

Size 144.65 x 68.58 mm. Coordinates in mm from the lower left corner, seen from the top.
Outline: 0,0 144.65,0 144.65,68.58 0,68.58 0,0
Copper layers (1*16): Top 0.018mm / dielectric 1.55mm / Bottom 0.018mm
Design rules "eC_2Layer_PClass6_BaseCopperO18_eCDefault *": minimum track width 0.15mm, minimum drill 0.35mm, track to track 0.15mm, track to pad 0.15mm, pad to pad 0.15mm, via to via 0.15mm, smd to smd 0mil, copper to edge 0.25mm, drill to drill 0.35mm, minimum pad ring 0.175mm, minimum via ring 0.125mm, stop-mask expansion 0mil, vias tented up to drill 0.5mm, thermal gap 0.2mm
Holes 3.2 mm at 3.05,64.9 141.6,64.9 141.6,3.68 3.05,3.68 34.16,64.9 34.16,3.68 123.7,64.9 123.7,3.68 40.43,3.68 141.6,34.29 123.7,34.29 3.05,34.29 34.16,34.29
Holes 1.6 mm at 115.82,62.23 117.92,62.23

### Footprints (pad centres in the part's own frame; a part is rotated, then mirrored left to right if it is on the bottom)
ELPP-BUZZER-12MM = drill 0.9 pad 1.8 octagon: + 3.25,0; - -3.25,0
ELPP-CNP-250 = drill 0.8 pad 1.6 octagon: 1 -1.25,0; 2 1.25,0
ELPP-CNP-508 = drill 0.8 pad 1.6 octagon: 1 -2.54,0; 2 2.54,0
ELPP-CNP-254 = drill 0.8 pad 1.6 octagon: 1 -1.27,0; 2 1.27,0
ELPP-CP-200-500 = drill 0.8 pad 1.6 octagon: + -1,0; - 1,0
ELPP-DO-41 = drill 1.2 pad 2.4 octagon: A 5.08,0; C -5.08,0
DIL40 = drill 0.813 long: 1 -24.13,-7.62; 2 -21.59,-7.62; 3 -19.05,-7.62; 4 -16.51,-7.62; 5 -13.97,-7.62; 6 -11.43,-7.62; 7 -8.89,-7.62; 8 -6.35,-7.62; 9 -3.81,-7.62; 10 -1.27,-7.62; 11 1.27,-7.62; 12 3.81,-7.62; 13 6.35,-7.62; 14 8.89,-7.62; 15 11.43,-7.62; 16 13.97,-7.62; 17 16.51,-7.62; 18 19.05,-7.62; 19 21.59,-7.62; 20 24.13,-7.62; 21 24.13,7.62; 22 21.59,7.62; 23 19.05,7.62; 24 16.51,7.62; 25 13.97,7.62; 26 11.43,7.62; 27 8.89,7.62; 28 6.35,7.62; 29 3.81,7.62; 30 1.27,7.62; 31 -1.27,7.62; 32 -3.81,7.62; 33 -6.35,7.62; 34 -8.89,7.62; 35 -11.43,7.62; 36 -13.97,7.62; 37 -16.51,7.62; 38 -19.05,7.62; 39 -21.59,7.62; 40 -24.13,7.62
DIL28-3 = drill 0.813 long: 1 -16.51,-3.81; 2 -13.97,-3.81; 3 -11.43,-3.81; 4 -8.89,-3.81; 5 -6.35,-3.81; 6 -3.81,-3.81; 7 -1.27,-3.81; 8 1.27,-3.81; 9 3.81,-3.81; 10 6.35,-3.81; 11 8.89,-3.81; 12 11.43,-3.81; 13 13.97,-3.81; 14 16.51,-3.81; 15 16.51,3.81; 16 13.97,3.81; 17 11.43,3.81; 18 8.89,3.81; 19 6.35,3.81; 20 3.81,3.81; 21 1.27,3.81; 22 -1.27,3.81; 23 -3.81,3.81; 24 -6.35,3.81; 25 -8.89,3.81; 26 -11.43,3.81; 27 -13.97,3.81; 28 -16.51,3.81
TO220V = drill 1.016 long: 1 -2.54,-2.54; 2 0,-2.54; 3 2.54,-2.54
ELPP-TO-92 = drill 0.8 pad 1.6 octagon: 1 -2.54,-1.27; 2 0,-1.27; 3 2.54,-1.27
SJ_2 = smd 1.168 x 1.6: 1 -1.524,0; 2 0,0; 3 1.524,0
ELPP-SIL-F-10-WAY = drill 0.8 long: 1 -11.43,0; 2 -8.89,0; 3 -6.35,0; 4 -3.81,0; 5 -1.27,0; 6 1.27,0; 7 3.81,0; 8 6.35,0; 9 8.89,0; 10 11.43,0
ELPP-SIL-M-6-WAY-90DEG = drill 1 long: 1 -6.35,0; 2 -3.81,0; 3 -1.27,0; 4 1.27,0; 5 3.81,0; 6 6.35,0
ELPP-DIL-M-6-WAY-V = drill 1 pad 1.7 square: 1 -2.54,-1.27 | drill 1 pad 1.7 octagon: 2 -2.54,1.27; 3 0,-1.27; 4 0,1.27; 5 2.54,-1.27; 6 2.54,1.27
ELPP-SIL-F-8-WAY = drill 0.8 long: 1 -8.89,0; 2 -6.35,0; 3 -3.81,0; 4 -1.27,0; 5 1.27,0; 6 3.81,0; 7 6.35,0; 8 8.89,0
ELPP-SIL-F-6-WAY = drill 0.8 long: 1 -6.35,0; 2 -3.81,0; 3 -1.27,0; 4 1.27,0; 5 3.81,0; 6 6.35,0
ELPP-SIL-M-3-WAY = drill 1 long: 1 -2.54,0; 2 0,0; 3 2.54,0
LCD_MULTI2 = drill 0.8 long: 1 -38.746,27.297; 2 -36.206,27.297; 3 -33.666,27.297; 4 -31.126,27.297; 5 -28.586,27.297; 6 -26.046,27.297; 7 -23.506,27.297; 8 -20.966,27.297; 9 -18.426,27.297; 10 -15.886,27.297; 11 -13.346,27.297; 12 -10.806,27.297; 13 -8.266,27.297; 14 -5.726,27.297; 15 -3.186,27.297; 16 -0.646,27.297 | hole 2.8: 46.754,27.297; 46.754,-27.703; -46.246,-27.703; -44.246,-3.703; 30.754,-3.703; 30.754,27.297
ELPP-SIL-M-5-WAY = drill 1 long: 1 -5.08,0; 2 -2.54,0; 3 0,0; 4 2.54,0; 5 5.08,0
ELPP-TB-350-2 = drill 1.1 pad 2.2 octagon: 1 -3.5,0; 2 0,0
ELPP-L-0207-1000 = drill 0.8 pad 1.6 octagon: 1 -5.08,0; 2 5.08,0
LED-TRICOLOR-THROUGHHOLE = drill 1: BLU 1,0; GND -1,0; GRN 3,0; RED -3,0
ELPP-TRIMMER-CB10-H = drill 1.2 pad 2.4 octagon: 1 -2.5,-5; 2 2.5,-5; 3 0,5
ELPP-R-0207-1000 = drill 0.8 pad 1.6 octagon: 1 -5.08,0; 2 5.08,0
PUSHBUTTON_MULTIMEC = drill 0.9: 1 5.08,3.81; 2 -5.08,3.81; 3 5.08,-3.81; 4 -5.08,-3.81
ALPS_EC12E_SW = drill 1: A -2.5,-7.5; B 2.5,-7.5; C 0,-7.5; D -2.5,7; E 2.5,7 | drill 2.2: GND1 -6.1,0; GND2 6.1,0
ALPS_EC12E_SW_ALT2 = drill 1: A -2.5,-7.5; B 2.5,-7.5; C 0,-7.5; D -2.5,7; E 2.5,7 | drill 2.2: GND2 6.1,0
TO-92 = drill 0.813 pad 1.88: 1 -1.27,0; 2 0,1.905; 3 1.27,0
ELPP-HC49 = drill 0.8 pad 1.6 octagon: 1 -2.413,0; 2 2.413,0

### Placement (x,y rotation side)
BUZ1  107.82,37.21 0 top
C1  79.88,23.5 270 top
C2  77.34,23.5 270 top
C3  46.99,12.95 180 top
C4  70.99,25.78 0 top
C5  44.96,54.61 90 top
C6  51.44,55.75 270 top
C7  79.38,13.33 270 top
C8  117.35,39.75 0 top
C9  79.38,3.81 270 top
C10  100.2,29.85 180 top
D1  114.3,10.79 270 top
D2  70.23,4.06 180 top
IC1  73.53,40.64 0 top
IC2  78.61,40.64 0 bottom
IC3  57.02,2.54 180 top
IC4  73.53,13.21 0 top
JP1  102.11,42.54 180 bottom
JP3  115.44,50.16 180 bottom
JP4  103.38,26.67 0 bottom
JP5  86.23,25.4 270 bottom
JP6  71.63,23.88 180 bottom
JP7  55.12,25.4 0 bottom
JP8  98.93,38.1 270 bottom
JP9  67.82,30.48 180 bottom
JP10  76.07,41.27 180 bottom
JP11  49.4,39.37 180 bottom
JP12  49.4,36.2 180 bottom
JP13  49.4,42.54 180 bottom
JP14  102.11,50.42 180 bottom
JP15  104.78,58.42 0 bottom
JP16  99.06,58.42 0 bottom
K1  58.29,62.23 0 top
K2  104.01,8.89 180 top
K3  41.78,39.37 90 top
K4  86.23,57.15 180 top
K5  64.64,57.15 180 top
K6  88.77,8.89 0 top
K7  70.99,8.89 0 top
K8  46.86,8.89 180 top
K9  71.63,34.92 0 bottom
K10  117.98,15.88 270 top
K11  123.06,15.88 270 top
K12  44.96,3.81 180 top
L1  42.42,52.7 90 top
LED1  112.27,18.42 0 bottom
LOGO1  123.06,51.31 90 top
LOGO2  98.42,4.06 0 bottom
P1  105.28,54.61 90 top
R1  111.63,27.94 180 top
R2  107.19,45.09 180 top
R3  81.15,59.69 0 top
R4  43.05,20.32 90 top
R5  40.51,20.32 270 top
R6  49.4,20.32 90 top
R7  46.86,20.32 270 top
R8  107.19,47.62 180 top
R9  111.63,25.4 180 top
R10  39.88,52.7 270 top
R11  115.57,48.26 270 top
R12  118.11,48.26 90 top
S1  101.47,18.42 90 bottom
S1A  133.22,57.15 0 bottom
S1B  24,11.43 180 bottom
S1C  12.06,57.15 180 bottom
S2  86.23,18.42 90 bottom
S2A  133.22,41.91 180 bottom
S2B  24,26.67 180 bottom
S2C  12.06,41.91 180 bottom
S3  70.99,18.42 90 bottom
S3A  133.22,26.67 0 bottom
S3B  24,41.91 180 bottom
S3C  12.06,26.67 180 bottom
S4  55.75,18.42 90 bottom
S4A  133.22,11.43 0 bottom
S4B  24,57.15 180 bottom
S4C  12.06,11.43 180 bottom
S5  93.85,18.42 180 bottom
S5A  133.22,48.89 180 bottom
S5B  24.26,18.42 180 bottom
S5C  12.06,48.89 180 bottom
S6  63.37,18.42 180 bottom
S6A  133.22,18.42 180 bottom
S6B  24.26,48.89 180 bottom
S6C  12.06,18.42 180 bottom
T1  113.67,56.52 270 top
U$2  43.94,19.94 0 bottom
X1  77.85,28.7 180 top

### Tracks (layer width: path | path; a pad name or v marks a point on that pad's centre or on a via)
!RESET  (via drill 0.4)
  Top 0.406: v63.75,28.83 64.64,27.94 K7.1 | v46.23,35.56 46.23,38.73 K3.5 44.32,43.18 v44.32,45.09
  Bottom 0.406: v46.23,35.56 45.59,34.92 45.59,33.66 46.23,33.02 46.23,30.48 48.13,28.58 63.5,28.58 v63.75,28.83 68.58,28.83 69.09,28.32 70.1,28.32 70.74,28.96 70.74,30.86 | JP8.3 99.06,36.58 99.57,36.07 99.57,32.13 97.66,30.23 97.66,30.1 | 97.66,30.1 95.25,30.1 94.36,29.21 82.3,29.21 80.64,30.86 70.74,30.86 | 70.74,30.86 70.74,31.37 69.72,32.38 IC1.9 | 97.66,30.1 C10.2 | R10.1 39.88,53.34 44.32,48.89 v44.32,45.09
!RTS  (via drill 0.8)
  Top 0.406: K2.6 97.66,10.79 98.93,12.06 98.93,13.97 97.66,15.24 97.66,19.69 98.93,20.96 98.93,28.58 v100.2,29.85
  Bottom 0.406: v100.2,29.85 C10.1
+3V3
  Top 0.61: K7.2 67.18,7.11 67.94,6.35 75.56,6.35 76.07,6.86 IC4.3 78.49,14.35 78.76,14.35 C7.+
+5V
  Top 0.813: K2.3 105.41,8.76 105.41,7.62 107.31,5.71 D1.A
AREF
  Top 0.406: IC1.32 69.72,48.89 67.82,50.8 64.64,50.8 60.83,54.61 57.15,54.61 55.75,56.01 K5.8 54.61,58.29 C6.1
  Bottom 0.406: IC2.21 77.34,45.09 75.82,46.61 75.82,50.42 74.17,52.07 70.36,52.07 69.72,51.43 IC1.32
AVCC  (via drill 0.4)
  Top 0.406: v57.02,45.72 57.66,45.72 58.55,46.61 74.8,46.61
  Top 0.61: IC2.20 74.8,46.61 IC1.30
  Bottom 0.61: L1.2 42.42,54.61 C5.1 44.96,50.16 49.4,45.72 v57.02,45.72
BLUE  (via drill 0.4)
  Top 0.406: v113.54,24.13 111.27,21.86 LED1.BLU
  Bottom 0.406: R8.1 114.17,45.72 114.17,44.2 113.67,43.69 113.67,35.69 111.63,33.66 111.63,26.04 v113.54,24.13
GATE
  Bottom 0.406: JP3.2 115.44,43.31 R11.2
GND  (via drill 0.4, 0.5, 0.8 pad 1.6)
  Top 0.406: 91.34,11.46 91.31,11.46 S5.D
  other vias: 17.14,59.44 17.14,58.29 17.14,57.15 17.14,56.01 17.14,54.86 17.14,51.56 17.14,43.05 120.52,19.69 17.14,41.91 17.14,40.77 17.14,39.62 17.14,36.58 17.14,35.43 17.14,34.29 17.14,33.15 17.14,32 17.14,28.96 17.14,27.81 17.14,26.67 17.14,25.53 17.14,24.38 17.14,20.57 17.14,13.72 17.14,12.57 17.14,11.43 17.14,10.29 17.14,9.14 17.14,6.1 17.14,4.95 17.14,3.81 17.14,2.67 17.14,1.52 17.14,62.48 17.14,63.63 17.14,64.77 17.14,65.91 17.14,67.06 120.52,17.15 120.52,12.06 120.9,61.98 120.78,63.25 120.52,64.26 120.52,65.41 120.52,66.55 120.52,60.71 120.52,59.69 120.52,58.55 120.52,56.26 120.52,55.12 120.52,53.98 120.52,52.83 120.52,57.4 120.52,50.55 120.52,49.4 120.52,48.26 120.52,45.97 120.52,44.83 120.52,43.69 120.52,42.54 120.52,47.12 120.52,51.69 120.52,40.26 120.52,39.12 120.52,37.97 120.52,35.69 120.52,34.54 120.52,33.4 120.52,32.26 120.52,36.83 120.52,29.97 120.52,28.83 120.52,27.69 120.52,25.4 120.52,24.26 120.52,23.11 120.52,21.97 120.52,26.54 120.52,31.12 120.52,41.4 120.52,10.92 120.52,9.78 120.52,14.61 120.52,8.64 120.65,6.22 120.52,5.21 120.52,4.06 120.52,2.92 120.78,7.62 120.52,1.78 37.34,11.05 37.34,9.91 37.34,8.76 37.34,7.62 37.34,13.08 37.34,6.48 37.34,5.33 37.34,4.19 37.34,3.05 37.34,1.91 37.34,14.22 37.34,15.37 37.34,16.51 37.34,17.65 37.34,18.8 37.34,19.94 37.34,21.08 37.34,23.24 37.34,25.27 37.34,27.31 37.34,29.34 37.34,30.48 37.34,31.62 37.34,32.77 37.34,33.91 37.34,35.05 37.34,36.2 37.34,37.34 37.34,38.48 37.34,39.62 37.34,40.77 37.34,41.91 37.34,43.05 37.34,44.2 37.34,45.34 37.34,46.48 37.34,47.62 37.34,48.77 37.34,49.91 37.34,51.05 37.34,52.2 37.34,53.34 37.34,54.48 37.34,55.63 37.34,56.77 37.34,57.91 37.34,59.05 37.34,60.2 37.34,61.34 37.34,62.48 37.34,63.63 37.34,64.77 37.34,65.91 37.34,67.06 44.96,54.61 51.44,55.75 46.99,12.95 53.85,36.58 54.23,41.66 45.59,41.15 90.42,34.92 102.62,41.02 82.93,50.55 72.64,29.85
  pour Top: 144.78,68.58 138.43,68.58 138.43,66.68 127,66.68 127,68.58 0,68.58 0,0 144.78,0
  pour Bottom: 0,0 144.78,0 144.78,68.58 138.43,68.58 138.43,66.68 127,66.68 127,68.58 0,68.58
GREEN
  Top 0.406: R1.1 115.44,27.94 109.09,21.59 109.09,18.59 LED1.GRN
LCD_BL_A
  Bottom 0.406: R3.1 74.8,60.96 74.8,62.21 K9.15
LCD_BL_K
  Bottom 0.406: K9.16 72.27,62.75 73.91,64.39 110.87,64.39 112.27,62.99 112.27,56.64 T1.3
LCD_E
  Bottom 0.406: K9.6 97.67,61.71 99.06,60.32 JP16.2
LCD_RS
  Bottom 0.406: K9.4 102.75,61.71 104.78,59.69 JP15.2
LCD_VO
  Top 0.406: K9.3 105.29,58.35 101.6,54.61 P1.3
MISO
  Bottom 0.406: JP12.2 49.4,37.46 43.69,37.46 K3.1
MOSI
  Bottom 0.305: JP13.2 49.4,43.81 46.86,43.81 43.69,40.64 41.78,40.64 K3.4
N$2
  Bottom 0.406: R2.1 112.27,38.35 BUZ1.+
N$5
  Bottom 0.406: T1.2 R11.1 R12.2
N$7
  Bottom 0.406: JP1.2 R2.2
N$8
  Bottom 0.406: R8.2 JP14.2
N$9
  Bottom 0.813: K8.3 44.32,4.45 K12.2 44.96,3.3 46.35,1.91 60.96,1.91 63.12,4.06 D2.A
PA0
  Bottom 0.406: K1.1 46.86,52.7 49.4,50.16 IC1.40
PA1
  Bottom 0.406: K1.2 49.4,52.7 51.94,50.16 IC1.39
PA2
  Bottom 0.406: IC1.38 54.48,50.29 53.34,51.43 53.34,59.05 52.07,60.32 52.07,62.1 K1.3
PA3
  Bottom 0.406: K1.4 54.48,52.7 57.02,50.16 IC1.37
PA4  (via drill 0.4)
  Top 0.406: IC1.36 59.56,49.91 v57.02,52.45
  Bottom 0.406: v57.02,52.45 K1.5
PA5  (via drill 0.4)
  Top 0.406: v59.56,52.45 62.1,49.91 IC1.35
  Bottom 0.406: v59.56,52.45 59.56,52.58 59.31,52.83 59.31,61.47 59.56,61.72 K1.6
PA6  (via drill 0.4)
  Top 0.406: v64.64,52.7 61.85,55.5 61.85,61.98 K1.7
  Bottom 0.406: IC1.34 v64.64,52.7
PA7  (via drill 0.4)
  Top 0.406: K1.8 64.64,61.85 64.9,61.59 64.9,55.63 v66.55,53.98
  Bottom 0.406: IC1.33 67.18,53.34 v66.55,53.98
PB0  (via drill 0.4)
  Top 0.406: IC2.14 62.1,36.2 60.83,34.92 v60.83,31.88 | v70.99,50.8 70.99,52.07 73.53,54.61 K5.1
  Bottom 0.406: v70.99,50.8 71.25,50.55 71.25,43.43 70.36,42.54 67.06,42.54 62.1,37.59 IC2.14 | v60.83,31.88 59.44,30.48 50.04,30.48 49.4,31.12 IC1.1 | K5.1 73.53,56.13 76.71,52.96 78.23,52.96 78.61,53.34 98.3,53.34 99.44,52.2 105.28,52.2 106.43,51.05 106.43,49.66 105.28,48.51 105.28,39.37 109.09,35.56 109.09,27.94 107.82,26.67 JP4.1
PB1  (via drill 0.4)
  Top 0.406: IC2.15 58.29,44.45 51.94,38.1 IC1.2 51.94,27.31 v51.31,26.67
  Bottom 0.406: IC2.15 62.1,45.97 61.09,46.99 61.09,49.53 62.36,50.8 62.36,58.42 63.88,59.94 67.31,59.94 67.82,59.44 69.72,59.44 70.99,58.17 K5.2 | JP5.1 85.98,26.67 81.66,26.67 81.41,26.42 78.49,26.42 78.23,26.67 76.58,26.67 76.2,26.29 73.53,26.29 72.77,27.05 67.18,27.05 66.93,27.31 51.94,27.31 v51.31,26.67
PB2  (via drill 0.4)
  Top 0.406: 55.75,34.92 54.48,33.66 IC1.3 | 55.75,34.92 55.75,37.59 57.4,39.24 58.55,39.24 61.72,42.42 63.25,42.42 64.64,43.81 IC2.16 | v67.82,25.4 67.82,26.67 64.01,30.48 58.93,30.48 58.04,31.37 58.04,34.16 57.28,34.92 55.75,34.92
  Bottom 0.356: IC2.16 64.64,45.09 65.66,46.1 65.66,52.83 64.9,53.59 64.9,58.42 65.28,58.8 66.8,58.8 K5.3
  Bottom 0.406: v67.82,25.4 67.82,24.77 68.71,23.88 JP6.1
PB3  (via drill 0.4)
  Top 0.406: IC2.17 67.18,43.31 65.28,41.4 62.1,41.4 57.4,36.7 v57.02,36.7 | IC1.4 57.02,27.31 v58.29,26.04
  Bottom 0.406: IC1.4 v57.02,36.7 57.02,41.27 55.75,42.54 JP13.3 | IC2.17 67.18,45.97 68.2,46.99 68.2,54.23 65.91,56.52 K5.4 | v58.29,26.04 56.64,26.04 JP7.1
PB4  (via drill 0.4)
  Top 0.406: IC1.5 59.56,37.21 62.61,40.26 v62.99,40.26 66.04,40.26 67.69,41.91 69.72,41.91 | 69.72,41.91 IC2.18 | 69.72,41.91 80.52,41.91 v80.9,41.53
  Bottom 0.406: JP12.3 50.93,35.94 50.67,35.56 50.67,31.75 51.31,31.12 58.93,31.12 59.56,31.75 IC1.5 | v62.99,40.26 63.12,40.39 63.12,56.39 63.37,56.64 K5.5 | JP1.1 98.93,42.54 97.66,41.27 81.15,41.27 v80.9,41.53
PB5  (via drill 0.4)
  Top 0.406: IC1.6 62.1,33.66 | v56.13,40.64 v58.29,40.64 | v109.22,49.53 104.27,49.53 v103.5,48.77
  Bottom 0.356: K5.6 60.83,57.4 61.09,57.66 61.09,63.75 62.99,65.66 111.25,65.66 113.41,63.5 113.41,60.96 115.32,59.05 116.84,59.05 119.76,56.13 119.76,51.18 118.75,50.16 117.47,50.16 JP3.3
  Bottom 0.406: 62.1,33.66 63.63,35.18 63.63,38.1 67.44,41.91 71.12,41.91 72.26,43.05 IC2.19 | 62.1,33.66 58.29,37.46 v58.29,40.64 58.29,49.53 60.83,52.07 K5.6 | 62.1,33.66 IC1.6 | v56.13,40.64 54.86,39.37 JP11.3 50.93,40.39 50.67,40.64 48.77,40.64 48.13,41.27 48.13,42.29 JP13.1 | v109.22,49.53 110.49,49.53 113.03,52.07 116.2,52.07 116.84,51.43 116.84,50.8 117.47,50.16 | JP14.3 103.63,48.89 v103.5,48.77
PB6  (via drill 0.4)
  Top 0.406: IC1.7 64.64,33.66 65.66,34.67 65.66,37.85 v67.82,40 | v75.31,42.67 76.2,43.56 76.2,53.98 78.74,56.52 78.74,63.5 80.26,65.02 100.08,65.02 101.47,63.63 101.47,60.45 v100.58,59.56
  Bottom 0.406: v67.82,40 68.33,40.51 73.79,40.51 JP10.1 74.55,41.91 v75.31,42.67 | JP12.1 47.88,31.37 49.4,29.85 62.1,29.85 64.64,32.38 IC1.7 | JP16.1 v100.58,59.56
PB6_DIP28  (via drill 0.4)
  Top 0.406: IC2.9 74.8,39.75 v75.69,40.64
  Bottom 0.406: v75.69,40.64 75.69,41.53 JP10.2
PB7  (via drill 0.4)
  Top 0.406: v46.86,34.29 47.5,34.92 47.5,39.5 v46.74,40.26 46.74,50.16 48.26,51.69 48.26,64.14 50.42,66.29 104.27,66.29 106.68,63.88 v106.68,59.56
  Bottom 0.406: v46.86,34.29 46.86,31.12 48.77,29.21 62.87,29.21 64.14,30.48 JP9.1 66.29,31.5 67.18,32.38 IC1.8 | v46.74,40.26 46.99,40.26 JP11.1 | JP15.1 106.68,58.8 v106.68,59.56
PB7_DIP28
  Bottom 0.406: JP9.2 68.07,30.73 68.07,31.62 68.45,32 68.45,34.04 69.09,34.67 70.74,34.67 72.26,36.2 IC2.10
PC0  (via drill 0.4)
  Top 0.406: IC2.23 82.42,43.43 83.19,42.67 83.19,40.64 81.41,38.86 81.41,29.97 v82.93,28.45 82.93,25.53 81.15,23.75 81.15,16.26 83.82,13.59 83.82,12.06 82.55,10.79 82.55,9.02 K6.1
  Bottom 0.406: IC1.22 95.12,50.16 93.6,51.69 82.68,51.69 81.41,50.42 81.41,47.12 82.42,46.1 IC2.23 | JP4.3 97.66,26.67 97.03,27.31 96.14,27.31 95.89,27.56 90.04,27.56 89.03,28.58 83.06,28.58 v82.93,28.45
PC1  (via drill 0.4)
  Top 0.406: IC2.24 84.96,39.88 83.95,38.86 83.95,31.88 84.33,31.5 v84.33,23.5 84.33,14.61 84.96,13.97 K6.2
  Bottom 0.406: IC1.23 92.58,50.16 92.08,50.67 84.84,50.67 83.69,49.53 83.69,46.99 84.96,45.72 IC2.24 | JP5.3 85.98,23.88 85.6,23.5 v84.33,23.5
PC2  (via drill 0.4)
  Top 0.406: IC2.25 87.5,40 86.49,38.99 86.49,21.72 v85.6,20.96 85.6,17.4 86.23,16.76 86.23,10.79 87.5,9.53 K6.3
  Bottom 0.406: IC1.24 90.04,48.89 88.9,50.04 86.74,50.04 86.23,49.53 86.23,46.99 87.5,45.72 IC2.25 | v85.6,20.96 83.06,18.42 77.47,18.42 73.15,22.73 JP6.3
PC3  (via drill 0.4)
  Top 0.406: IC2.26 90.04,39.75 89.03,38.73 89.03,30.99 87.5,29.46 87.5,21.72 90.04,19.18 90.04,17.15 v88.77,15.88 88.77,11.43 90.04,10.16 K6.4
  Bottom 0.406: IC1.25 87.5,47.62 90.04,45.09 IC2.26 | v88.77,15.88 86.23,15.88 84.96,17.15 73.03,17.15 72.01,16.13 68.2,16.13 67.82,16.51 63.37,16.51 57.02,22.86 54.48,22.86 53.21,24.13 53.21,24.77 JP7.3
PC4  (via drill 0.4)
  Top 0.406: IC2.27 92.58,39.5 91.57,38.48 91.57,29.46 v90.42,28.32 88.52,26.42 88.52,22.73 92.58,18.67 K6.5
  Bottom 0.406: IC1.26 84.96,46.99 86.23,45.72 86.23,43.18 86.87,42.54 91.95,42.54 92.58,43.18 IC2.27 | JP1.3 103.63,40.26 100.84,37.46 100.84,32.38 98.93,30.48 98.93,29.21 98.3,28.58 97.03,28.58 96.14,29.46 95.5,29.46 94.36,28.32 v90.42,28.32
PC5  (via drill 0.4)
  Top 0.406: IC2.28 95.12,38.86 94.11,37.85 94.11,28.58 | K6.6 95.12,10.16 93.85,11.43 93.85,24.13 92.71,25.27 92.71,27.18 94.11,28.58 | v99.57,46.35 v106.55,46.35 | 94.11,28.58 v95.76,28.58
  Bottom 0.406: IC1.27 82.42,47.12 83.69,45.85 83.69,43.18 84.96,41.91 95.12,41.91 | IC2.28 95.12,41.91 | v106.55,46.35 108.71,46.35 112.52,50.16 JP3.1 | v95.76,28.58 96.39,27.94 R1.2 | v99.57,46.35 98.93,45.72 98.93,44.45 96.39,41.91 95.12,41.91
PC6  (via drill 0.4)
  Top 0.406: R9.2 107.82,25.4 109.09,26.67 109.09,36.83 105.92,40 v101.47,40 | IC1.28 79.88,49.15 77.47,51.56 v77.47,54.1
  Bottom 0.406: IC1.28 79.88,46.99 80.9,45.97 80.9,42.67 80.14,41.91 80.14,41.15 80.64,40.64 97.66,40.64 98.3,40 98.55,40 JP8.1 99.31,40 v101.47,40 | v77.47,54.1 75.44,56.13 75.44,57.78 73.53,59.69 72.26,59.69 K1.10
PC6_DIP28
  Bottom 0.406: IC2.1 96.39,36.83 97.66,38.1 JP8.2
PC7
  Bottom 0.356: K1.9 67.18,61.59 68.2,60.58 70.1,60.58 72.52,58.17 72.52,55.88 76.07,52.32 77.34,52.32
  Bottom 0.406: IC1.29 77.34,52.32 78.49,52.32 78.87,52.7 97.03,52.7 99.31,50.42 JP14.1
PD0/RX
  Top 0.406: IC2.2 92.58,37.85 94.11,39.37 94.11,46.1 | K2.4 102.74,15.88 104.01,17.15 104.01,32.38 100.2,36.2 100.2,43.56 97.66,46.1 94.11,46.1 | 94.11,46.1 94.11,54.23 95.12,55.24 K4.1
  Bottom 0.406: IC2.2 92.58,35.18 93.85,33.91 93.85,31.75 92.58,30.48 84.07,30.48 82.42,32.13 IC1.14
PD1/TX  (via drill 0.4)
  Top 0.406: IC2.3 90.04,38.73 91.06,39.75 v91.06,46.35 91.06,53.72 92.58,55.24 K4.2 | K2.5 100.2,10.79 100.84,11.43 100.84,15.88 102.74,17.78 102.74,20.45 101.47,21.72 101.47,33.02 98.93,35.56 98.93,42.54 v97.03,44.45
  Bottom 0.406: IC2.3 90.04,37.46 88.65,38.86 84.07,38.86 83.44,38.23 83.44,35.69 84.96,34.16 IC1.15 | v97.03,44.45 97.03,45.47 96.01,46.48 91.19,46.48 v91.06,46.35
PD2
  Top 0.406: IC1.16 IC2.4 87.5,38.99 88.52,40 88.52,53.72 90.04,55.24 K4.3
  Bottom 0.406: JP15.3 103.25,58.17 101.85,56.77 96.9,56.77 96.52,57.15 96.52,58.55 95.89,59.18 90.81,59.18 90.04,58.42 K4.3
PD3
  Top 0.406: IC2.5 84.96,38.99 85.98,40 85.98,53.72 87.5,55.24 K4.4
  Bottom 0.406: IC2.5 84.96,36.2 86.49,34.67 89.41,34.67 90.04,34.04 IC1.17 | JP16.3 97.54,59.82 97.16,60.2 88.27,60.2 87.63,59.56 87.63,57.28 K4.4
PD4
  Top 0.406: IC2.6 82.42,38.86 83.95,40.39 83.95,54.23 84.96,55.24 K4.5
  Bottom 0.406: IC2.6 82.42,35.18 83.44,34.16 83.44,32.26 84.58,31.12 90.68,31.12 IC1.18 | K4.5 84.96,62.21 K9.11
PD5  (via drill 0.4)
  Top 0.406: v78.99,39.37 80.52,39.37 82.17,41.02 82.17,42.04 80.9,43.31 80.9,53.72 82.42,55.24 K4.6
  Bottom 0.406: IC1.19 95.12,31.75 93.22,29.85 83.44,29.85 81.41,31.88 81.41,37.85 80.52,38.73 79.5,38.73 78.99,39.24 | IC2.11 69.72,37.97 70.99,39.24 78.99,39.24 | K4.6 82.42,62.21 K9.12 | 78.99,39.24 v78.99,39.37
PD6  (via drill 0.4)
  Top 0.406: v79.25,51.43 79.88,52.07 K4.7
  Bottom 0.406: IC1.20 97.66,33.66 96.65,34.67 94.49,34.67 93.6,35.56 93.6,38.73 92.84,39.5 80.26,39.5 79.12,40.64 | K4.7 79.88,62.21 K9.13 | 79.12,40.64 79.12,43.05 78.87,43.31 78.87,51.05 v79.25,51.43 | IC2.12 67.18,37.46 69.6,39.88 78.36,39.88 79.12,40.64
PD7  (via drill 0.4)
  Top 0.406: IC1.21 97.66,48.89 97.03,49.53 v97.03,54.61 | v73.53,50.8 73.53,52.45 77.34,56.26 K4.8
  Bottom 0.406: v97.03,54.61 78.61,54.61 77.34,55.88 K4.8 77.34,60.96 77.36,62.21 | IC2.13 64.64,38.1 67.82,41.27 71.63,41.27 73.28,42.93 73.28,50.55 v73.53,50.8 | 77.36,62.21 77.34,62.21 | 77.36,62.21 K9.14
RED
  Top 0.406: R9.1 115.44,24.13 115.44,18.59 LED1.RED
S1
  Top 0.406: S1B.1 29.08,12.83 26.67,15.24 26.67,25.83 S5B.B 26.76,25.95 23.5,29.21 23.5,46.99 S1C.1
  Bottom 0.406: S5A.B 135.72,57.19 131.95,60.96 S1A.1 128.14,55.88 129.41,54.61 129.41,35.94 125.6,32.13 125.6,22.86 123.7,20.96 K11.1 K10.1 107.82,20.96 S1.1 104.65,23.5 103.38,24.77 | 43.05,27.94 67.18,27.94 67.44,27.69 73.03,27.69 73.79,26.92 75.82,26.92 76.2,27.31 78.61,27.31 78.87,27.05 81.15,27.05 81.41,27.31 84.33,27.31 84.96,27.94 87.5,27.94 88.14,27.31 88.14,26.04 89.41,24.77 90.3,24.77 90.93,24.13 95.76,24.13 96.39,24.77 | S5.B 96.35,24.81 96.39,24.77 | 103.38,24.77 JP4.2 | 96.39,24.77 103.38,24.77 | 43.05,27.94 R4.2 | 43.05,27.94 42.67,28.32 29.16,28.32 S5B.B | S5C.B 14.56,55.92 S1C.1
S2  (via drill 0.4)
  Top 0.406: S5.A 91.35,24.81 S2.1 | v72.26,13.46 72.26,15.11 77.47,20.32 v79.88,20.32 | R5.1 40.51,21.46 v39.37,20.32 | S6C.E 14.56,23.46 15.88,24.77 15.88,27.31 14.61,28.58 14.61,35.56 S2C.1
  Bottom 0.406: 132.59,44.45 130.68,46.35 130.68,56.35 S5A.A | S6A.E 137.03,12.72 137.03,36.83 S2A.1 138.3,41.91 135.76,44.45 132.59,44.45 | 132.59,44.45 132.59,37.08 126.62,31.12 126.62,21.34 123.7,18.42 K11.2 K10.2 117.47,18.42 116.2,19.69 105.92,19.69 103.38,22.23 97.03,22.23 95.76,23.5 S2.1 89.41,23.5 87.5,25.4 JP5.2 84.96,25.4 83.57,24 83.57,22.73 81.15,20.32 v79.88,20.32 | v72.26,13.46 72.26,11.3 71.63,10.67 66.8,10.67 66.04,11.43 65.89,11.43 S6.E 63.36,11.41 61.47,9.53 52.58,9.53 50.67,11.43 40.77,11.43 38.73,13.33 38.73,19.69 v39.37,20.32 | R5.1 39.62,26.29 32.51,26.29 S2B.1 24.13,22.86 21.76,25.23 S5B.A 21.76,39.2 21.59,39.37 | S6B.E 24.75,41.89 22.23,39.37 21.59,39.37 | 21.59,39.37 18.41,39.37 S2C.1 14.61,38.1 11.43,41.27 11.43,54.53 S5C.A
S3  (via drill 0.4)
  Top 0.406: v95.25,21.84 95.25,12.52 S5.E | v53.85,22.23 v62.74,22.23 | v71.63,21.34 72.64,21.34 S3.1 | S5B.E 26.76,13.25 S3C.1 | S3B.1 29.08,33.15 33.66,28.58 v33.66,22.23
  Bottom 0.406: 135.72,30.48 S6A.B | 135.72,30.48 S5A.E | 135.72,30.48 S3A.1 128.14,25.4 129.41,24.13 129.41,17.4 128.78,16.76 128.14,16.51 126.24,15.88 K11.3 K10.3 116.84,15.88 115.19,14.22 109.22,14.22 101.85,21.59 95.5,21.59 v95.25,21.84 85.22,21.84 82.42,19.05 77.98,19.05 74.8,22.23 S3.1 | 49.4,22.23 v53.85,22.23 | 65.91,22.23 65.91,25.88 S6.B | v62.74,22.23 65.91,22.23 | 49.4,22.23 R6.2 | 65.91,22.23 71.63,22.23 v71.63,21.34 JP6.2 | S3B.1 29.21,38.23 29.21,42.54 27.56,44.2 27.3,44.2 | S6B.B 28.7,56.39 30.48,54.61 30.48,52.7 27.3,49.53 27.3,44.2 | 49.4,22.23 v33.66,22.23 33.66,15.24 29.84,11.43 26.77,11.43 S5B.E | 27.3,44.2 16.87,44.2 S5C.E | S6C.B 14.56,25.44 S3C.1
S4  (via drill 0.4)
  Top 0.406: S6B.A 21.76,50.63 24.77,47.62 24.77,31.12 28.57,27.31 28.57,24.77 27.94,24.13 27.94,21.59 v28.57,20.96
  Bottom 0.406: 10.79,21.59 27.94,21.59 v28.57,20.96 29.84,20.96 33.02,24.13 36.32,24.13 36.45,24.26 38.23,24.26 38.73,23.75 45.21,23.75 R7.1 48.13,26.67 50.04,26.67 50.93,25.78 51.69,25.78 52.58,26.67 55.12,26.67 JP7.2 55.12,24.13 59.56,24.13 | S6A.A 130.72,16.42 129.54,15.24 S4A.1 126.24,13.33 K11.4 K10.4 109.09,13.33 101.47,20.96 86.87,20.96 83.69,17.78 73.53,17.78 70.36,20.96 62.1,20.96 S4.1 59.56,24.13 | 59.56,24.13 60.83,25.4 60.99,26.04 S6.A | S6B.A 21.76,55.08 23.5,53.34 S4B.1 | S4C.1 15.88,7.62 10.79,12.7 10.79,21.59 | 10.79,21.59 10.79,24.69 S6C.A
SCK
  Bottom 0.406: JP11.2 49.4,38.1 46.23,38.1 44.96,39.37 K3.3
VCC  (via drill 0.4)
  Top 0.406: R3.2 95.89,59.69 98.17,57.4 98.17,53.85 99.69,52.32 103.12,52.32 107.95,57.15
  Top 0.813: IC1.10 72.26,32.38 70.36,30.48 68.45,30.48 67.82,29.85 67.82,28.58 69.72,26.67 C4.1 69.72,23.5 66.55,20.32 v66.55,15.24 | 114.3,39.75 114.3,35.56 111.63,32.89 111.63,26.67 107.31,22.35 107.31,15.88 | 114.3,39.75 114.3,41.91 113.67,42.54 113.67,43.81 114.17,44.32 114.17,51.56 110.49,55.24 110.49,56.9 P1.2 107.99,57.11 107.95,57.15 107.83,57.27 K9.2 | v44.96,29.21 44.96,17.15 R4.1 | 114.3,39.75 C8.+ | D1.C 107.31,15.88 | 107.31,15.88 v104.78,15.88 | v73.53,14.86 IC4.2 73.53,11.3 73.03,10.79 71.88,10.79 71.25,10.16 70.48,10.16 69.85,9.53 69.85,9.02 K7.3 | IC3.3 50.8,5.08 50.16,5.71 48.26,5.71 46.99,6.98 46.99,8.76 K8.2 46.86,10.16 49.53,12.83 C3.1 49.4,13.08 R6.1
  Bottom 0.406: R7.2 46.23,15.24
  Bottom 0.762: IC2.7 79.88,36.2 78.61,34.92 73.53,34.92 72.26,33.66 IC1.10
  Bottom 0.813: v44.96,29.21 44.96,31.24 40.51,35.69 K3.2 38.61,38.73 38.61,46.35 R10.2 L1.1 | R5.2 R4.1 R7.2 R6.1 v66.55,15.24 67.18,15.24 67.56,14.86 v73.53,14.86 73.79,14.86 74.8,15.88 82.42,15.88 83.69,14.61 89.41,14.61 90.04,15.24 104.14,15.24 v104.78,15.88
VIN
  Bottom 0.813: 77.47,4.81 76.06,4.81 D2.C 68.33,4.06 66.04,6.35 60.83,6.35 IC3.1 | 77.47,4.81 C9.+ | K7.6 77.47,8.76 77.47,4.81
XTAL1  (via drill 0.4)
  Top 0.406: v77.22,40.64 77.22,39.5 78.36,38.35 78.36,35.56 79.88,34.04 IC1.13 79.88,29.21 80.26,28.83 X1.1 79.88,28.32 C1.1
  Bottom 0.406: v77.22,40.64 77.22,41.4 JP10.3
XTAL2  (via drill 0.4)
  Top 0.406: v69.6,29.08 69.98,28.7 X1.2 77.34,28.7 | C2.1 77.34,28.7 | 77.34,28.7 IC1.12
  Bottom 0.406: JP9.3 69.34,29.34 v69.6,29.08

### Text on the board
Top: TOP | 1
Bottom: BOTTOM | 1
tPlace: PA0 | PA1 | PA2 | PA3 | PA4 | PA5 | PA6 | PA7 | PC7 | PC6 | K | A | PD7 | PD6 | PD5 | PD4 | NC | NC | NC | NC | PD3/ / PB6 | GND | PD2/ / PB7 | VO | VCC | GND | DRILL / TO SIZE | CONTRAST | S1 | S4 | S1 | AREF | GND | PB5 | +PB4 | ±PB3 | -PB2 | -PB1 | PB0 | +PD7 | ±PD6 | ±PD5 | +PD4 | -PD3 | PD2 | TX/PD1 | RX/PD0 | UNIVERSAL AVR BOARD | E1 | E2 | E1 | RST | b | GND | ISP | MO | SCK | DIP-40 GOES HERE | S2 | S3 | VCC | MI | S2 | CUT HERE | S3 | S2 | S3 | CUT HERE | CUT HERE | CC | E2 | E1 | E2 | S3 | S2 | E1 | S1 | E2 | S4 | S1 | DETACHABLE KEYPAD | VIN | VCC | GND | RTS | TX/PD1 | RX/PD0 | +5V | CTS | GND | S4 | PC0 | PC1 | PC2 | PC3 | PC4 | PC5 | S4 | RST | 3V3 | 5V | GND | GND | VIN | VIN | GRN | BLK | GND
bPlace: C | B | A | K | A | D7 | D6 | D5 | D4 | LCD | E | GND | RS | VO | VCC | GND | DRILL / TO SIZE | 16 | 1 | D | B | D | B | 1 | 1 | 4 | LCD-E | LCD-RS | C | B | BACKLIGHT | E1 | E2 | LED1 | E1 | C | B | ISP | MOSI | XTAL | BUZZER | 2 | 3 | DIP28 | DIP40 | SCK | PB6 | DIP-28 | B | C | 2 | CRYSTAL | GOES HERE | DIP40 | MISO | DIP28 | !RESET | XTAL | S4 | PB7 | S2 | S1 | CRYSTAL | 3 | S3 | E1 | 2 | C | B | B | C | B | C | 3 | B | C | E2 | 4 | 2 | 3 | E2 | E1 | 1 | 4 | 1 | POWER IN | 4 | VIN | +5V | GND | E2